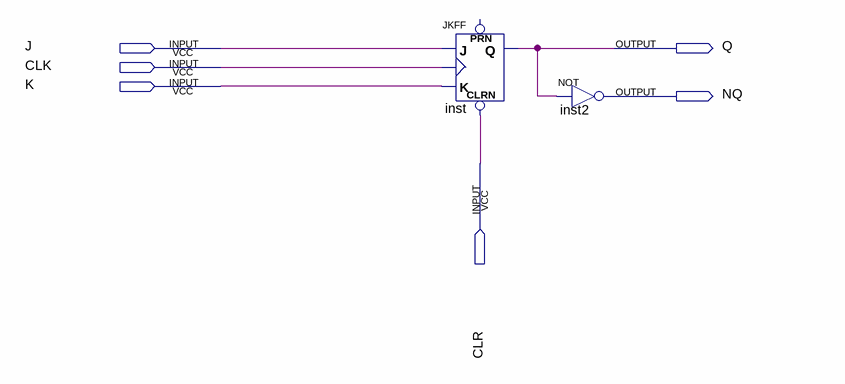
[diagram p0: schematic sheet]
// Quartus schematic ALP74LS107.bdf as structural Verilog: 2 symbols, 6 pins
module ALP74LS107 (
  input  J,
  input  CLK,
  input  K,
  input  CLR,
  output Q,
  output NQ
);

  JKFF inst (.CLRN(CLR), .K(K), .J(J), .CLK(CLK), .Q(Q));  // open: PRN
  not inst2 (NQ, Q);
endmodule
